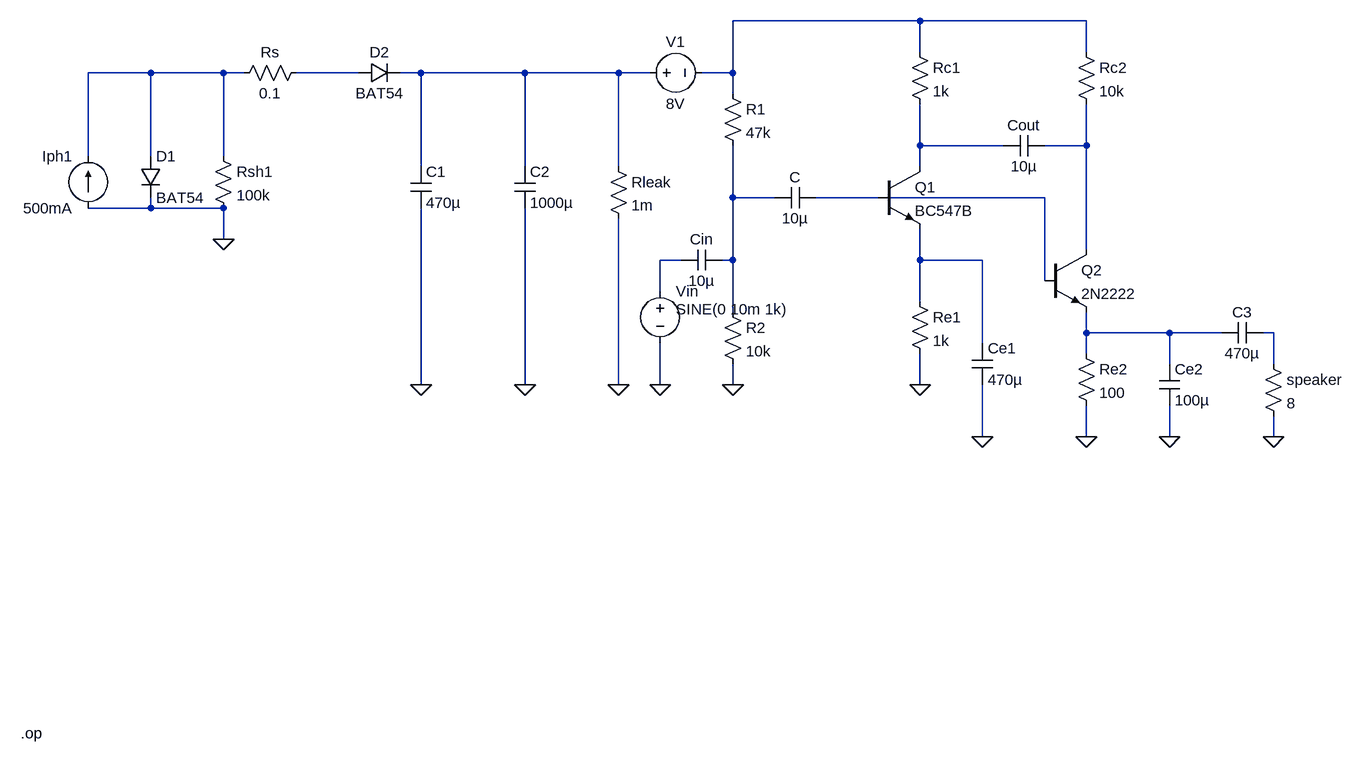
[diagram p0: schematic finalsolaraudioamp.asc]
finalsolaraudioamp.asc, the LTspice schematic file:
Version 4.1
SHEET 1 1940 1032
WIRE 1280 -80 992 -80
WIRE 1536 -80 1280 -80
WIRE 1280 -32 1280 -80
WIRE 1536 -32 1536 -80
WIRE 96 0 0 0
WIRE 208 0 96 0
WIRE 240 0 208 0
WIRE 416 0 320 0
WIRE 512 0 480 0
WIRE 672 0 512 0
WIRE 816 0 672 0
WIRE 864 0 816 0
WIRE 992 0 992 -80
WIRE 992 0 944 0
WIRE 992 32 992 0
WIRE 1280 112 1280 48
WIRE 1408 112 1280 112
WIRE 1536 112 1536 48
WIRE 1536 112 1472 112
WIRE 0 128 0 0
WIRE 96 128 96 0
WIRE 208 128 208 0
WIRE 512 144 512 0
WIRE 672 144 672 0
WIRE 816 144 816 0
WIRE 1280 144 1280 112
WIRE 992 192 992 112
WIRE 1056 192 992 192
WIRE 1216 192 1120 192
WIRE 1472 192 1232 192
WIRE 96 208 96 192
WIRE 96 208 0 208
WIRE 208 208 96 208
WIRE 208 256 208 208
WIRE 1536 272 1536 112
WIRE 912 288 880 288
WIRE 992 288 992 192
WIRE 992 288 976 288
WIRE 1280 288 1280 240
WIRE 1376 288 1280 288
WIRE 1472 320 1472 192
WIRE 880 336 880 288
WIRE 1280 352 1280 288
WIRE 992 368 992 288
WIRE 1536 400 1536 368
WIRE 1664 400 1536 400
WIRE 1744 400 1664 400
WIRE 1824 400 1808 400
WIRE 1376 416 1376 288
WIRE 1536 432 1536 400
WIRE 1664 448 1664 400
WIRE 1824 448 1824 400
WIRE 512 480 512 208
WIRE 672 480 672 208
WIRE 816 480 816 224
WIRE 880 480 880 416
WIRE 992 480 992 448
WIRE 1280 480 1280 432
WIRE 1376 560 1376 480
WIRE 1536 560 1536 512
WIRE 1664 560 1664 512
WIRE 1824 560 1824 528
FLAG 512 480 0
FLAG 672 480 0
FLAG 816 480 0
FLAG 992 480 0
FLAG 1280 480 0
FLAG 1376 560 0
FLAG 1536 560 0
FLAG 1664 560 0
FLAG 1824 560 0
FLAG 880 480 0
FLAG 208 256 0
SYMBOL current 0 208 R180
WINDOW 0 24 80 Left 2
WINDOW 3 24 0 Left 2
WINDOW 123 0 0 Left 0
WINDOW 39 0 0 Left 0
SYMATTR InstName Iph1
SYMATTR Value 500mA
SYMBOL diode 80 128 R0
SYMATTR InstName D1
SYMATTR Value BAT54
SYMATTR Description Diode
SYMATTR Type diode
SYMBOL res 192 112 R0
SYMATTR InstName Rsh1
SYMATTR Value 100k
SYMBOL res 336 -16 R90
WINDOW 0 0 56 VBottom 2
WINDOW 3 32 56 VTop 2
SYMATTR InstName Rs
SYMATTR Value 0.1
SYMBOL diode 416 16 R270
WINDOW 0 32 32 VTop 2
WINDOW 3 0 32 VBottom 2
SYMATTR InstName D2
SYMATTR Value BAT54
SYMATTR Description Diode
SYMATTR Type diode
SYMBOL cap 496 144 R0
SYMATTR InstName C1
SYMATTR Value 470µ
SYMBOL cap 656 144 R0
SYMATTR InstName C2
SYMATTR Value 1000µ
SYMBOL res 800 128 R0
SYMATTR InstName Rleak
SYMATTR Value 1m
SYMBOL res 976 16 R0
SYMATTR InstName R1
SYMATTR Value 47k
SYMBOL npn 1216 144 R0
SYMATTR InstName Q1
SYMATTR Value BC547B
SYMBOL cap 1056 208 R270
WINDOW 0 32 32 VTop 2
WINDOW 3 0 32 VBottom 2
SYMATTR InstName C
SYMATTR Value 10µ
SYMBOL cap 912 304 R270
WINDOW 0 32 32 VTop 2
WINDOW 3 0 32 VBottom 2
SYMATTR InstName Cin
SYMATTR Value 10µ
SYMBOL res 1264 -48 R0
SYMATTR InstName Rc1
SYMATTR Value 1k
SYMBOL cap 1472 96 R90
WINDOW 0 0 32 VBottom 2
WINDOW 3 32 32 VTop 2
SYMATTR InstName Cout
SYMATTR Value 10µ
SYMBOL res 1520 -48 R0
SYMATTR InstName Rc2
SYMATTR Value 10k
SYMBOL npn 1472 272 R0
SYMATTR InstName Q2
SYMATTR Value 2N2222
SYMBOL res 1520 416 R0
SYMATTR InstName Re2
SYMATTR Value 100
SYMBOL cap 1648 448 R0
SYMATTR InstName Ce2
SYMATTR Value 100µ
SYMBOL res 1264 336 R0
SYMATTR InstName Re1
SYMATTR Value 1k
SYMBOL cap 1360 416 R0
SYMATTR InstName Ce1
SYMATTR Value 470µ
SYMBOL res 1808 432 R0
SYMATTR InstName speaker
SYMATTR Value 8
SYMBOL res 976 352 R0
SYMATTR InstName R2
SYMATTR Value 10k
SYMBOL voltage 880 320 R0
WINDOW 3 24 44 Left 2
WINDOW 123 0 0 Left 0
WINDOW 39 0 0 Left 0
SYMATTR InstName Vin
SYMATTR Value SINE(0 10m 1k)
SYMBOL cap 1808 384 R90
WINDOW 0 0 32 VBottom 2
WINDOW 3 32 32 VTop 2
SYMATTR InstName C3
SYMATTR Value 470µ
SYMBOL voltage 848 0 R270
WINDOW 0 32 56 VTop 2
WINDOW 3 -32 56 VBottom 2
SYMATTR InstName V1
SYMATTR Value 8V
TEXT -104 1016 Left 2 !.op

The netlist it stands for:
* finalsolaraudioamp.asc
Iph1 0 N002 500mA
D1 N002 0 BAT54
Rsh1 N002 0 100k
Rs N003 N002 0.1
D2 N003 N004 BAT54
C1 N004 0 470µ
C2 N004 0 1000µ
Rleak N004 0 1m
R1 N001 N007 47k
Q1 N005 N008 N011 0 BC547B
C N007 N008 10µ
Cin N010 N007 10µ
Rc1 N001 N005 1k
Cout N006 N005 10µ
Rc2 N001 N006 10k
Q2 N006 N009 N012 0 2N2222
Re2 N012 0 100
Ce2 N012 0 100µ
Re1 N011 0 1k
Ce1 N011 0 470µ
R§speaker N013 0 8
R2 N007 0 10k
Vin N010 0 SINE(0 10m 1k)
C3 N013 N012 470µ
V1 N004 N001 8V
.model D D
.lib standard.dio
.model NPN NPN
.model PNP PNP
.lib standard.bjt
.op
.backanno
.end